# EAGLE design pico (EAGLE 6.4)
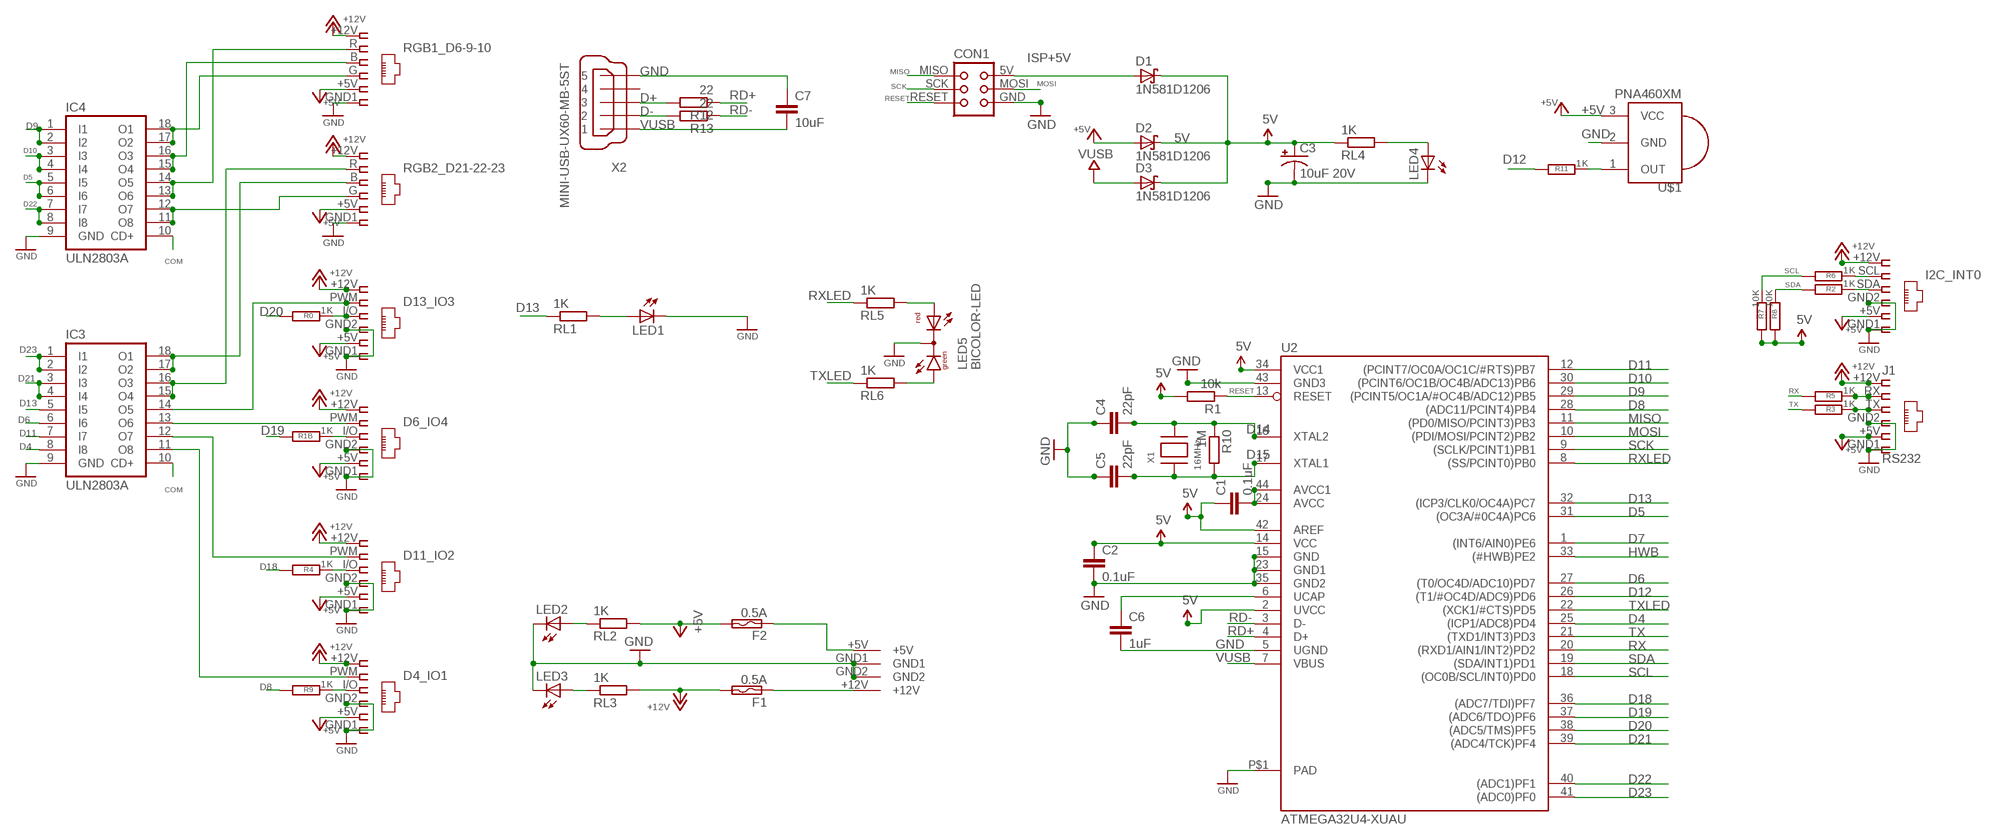
[diagram p0: schematic, sheet 1]

## Parts
C1  0.1uF  C-EUC1206  [C1206]
C2  0.1uF  C-EUC1206  [C1206]
C3  10uF 20V  CAP_POL1206-KIT  [EIA3216-KIT]
C4  22pF  C-EUC1206  [C1206]
C5  22pF  C-EUC1206  [C1206]
C6  1uF  C-EUC1206  [C1206]
C7  10uF  C-EUC1206  [C1206]
CON1  TINYISPT  [TC2030-MCP-NL]
D1  1N581D1206  [LED-1206]
D2  1N581D1206  [LED-1206]
D3  1N581D1206  [LED-1206]
D4_IO1  IO1  RJ12STRAIGHT  [RJ12-STRAIGHT]
D6_IO4  IO3  RJ12STRAIGHT  [RJ12-STRAIGHT]
D11_IO2  IO2  RJ12STRAIGHT  [RJ12-STRAIGHT]
D13_IO3  IO4  RJ12STRAIGHT  [RJ12-STRAIGHT]
F1  0.5A  POLYSWITCHSMD1812  [C1812]
F2  0.5A  POLYSWITCHSMD1812  [C1812]
I2C_INT0  I2C  RJ12STRAIGHT-I2C  [RJ12-STRAIGHT-I2C]
IC3  ULN2803A  [SO18W]
IC4  ULN2803A  [SO18W]
J1  RS232  RJ12STRAIGHT-RS232-SERVER  [RJ12-STRAIGHT-RS232]
LED1  LED3MM  [LED3MM]
LED2  5V  LED3MM  [LED3MM]
LED3  12V  LED3MM  [LED3MM]
LED4  5V uC  LED3MM  [LED3MM]
LED5  BICOLOR-LED  [BICOLOR-3MM]
R0  1K  R-EU_M1206  [M1206]
R1  10k  R-EU_M1206  [M1206]
R1B  1K  R-EU_M1206  [M1206]
R2  1K  R-EU_M1206  [M1206]
R3  1K  R-EU_M1206  [M1206]
R4  1K  R-EU_M1206  [M1206]
R5  1K  R-EU_M1206  [M1206]
R6  1K  R-EU_M1206  [M1206]
R7  10K  R-EU_M1206  [M1206]
R8  10K  R-EU_M1206  [M1206]
R9  1K  R-EU_M1206  [M1206]
R10  1M  R-EU_M1206  [M1206]
R11  1K  R-EU_M1206  [M1206]
R12  22  R-EU_M1206  [M1206]
R13  22  R-EU_M1206  [M1206]
RGB1_D6-9-10  RGB1  RJ12STRAIGHT-RGB  [RJ12-STRAIGHT-RGB]
RGB2_D21-22-23  RGB2  RJ12STRAIGHT-RGB  [RJ12-STRAIGHT-RGB]
RL1  1K  R-EU_M1206  [M1206]
RL2  1K  R-EU_M1206  [M1206]
RL3  1K  R-EU_M1206  [M1206]
RL4  1K  R-EU_M1206  [M1206]
RL5  1K  R-EU_M1206  [M1206]
RL6  1K  R-EU_M1206  [M1206]
U2  ATMEGA32U4-XUAU  [TQFP44-PAD]
U$1  PNA460XM  [PNA460XM]
U$2  KPJX-4S-S  [KPJX-4S-S]
X1  16MHz  XTALNX6035  [NX6035]
X2  MINI-USB-UX60-MB-5ST  [UX60-MB-5ST]

## Nets
5V: C1.1 C2.1 C3.A(+) D1.C D2.C D3.C R1.2 R7.2 R8.2 RL4.1 U2.2(UVCC) U2.14(VCC) U2.34(VCC1) U2.42(AREF)
+5V: D2.A D4_IO1.+5V D6_IO4.+5V D11_IO2.+5V D13_IO3.+5V F2.2 I2C_INT0.+5V J1.+5V RGB1_D6-9-10.+5V RGB2_D21-22-23.+5V RL2.2 U$1.3(VCC)
+12V: D4_IO1.+12V D6_IO4.+12V D11_IO2.+12V D13_IO3.+12V F1.2 I2C_INT0.+12V J1.+12V RGB1_D6-9-10.+12V RGB2_D21-22-23.+12V RL3.2
COM: IC3.10(CD+) IC4.10(CD+)
D2B: D11_IO2.I/O R4.1
D2B1: D4_IO1.I/O R9.1
D2B4: I2C_INT0.SDA R2.1
D2B5: J1.TX R3.1
D2B6: D13_IO3.I/O R0.1
D2B7: D6_IO4.I/O R1B.1
D4 [fine]: IC3.8(I8) U2.25((ICP1/ADC8)PD4)
D5 [fine]: IC4.5(I5) IC4.6(I6) U2.31((OC3A/#0C4A)PC6)
D6 [fine]: IC3.6(I6) U2.27((T0/OC4D/ADC10)PD7)
D7: U2.1((INT6/AIN0)PE6)
D8 [fine]: R9.2 U2.28((ADC11/PCINT4)PB4)
D9 [fine]: IC4.1(I1) IC4.2(I2) U2.29((PCINT5/OC1A/#OC4B/ADC12)PB5)
D10 [fine]: IC4.3(I3) IC4.4(I4) U2.30((PCINT6/OC1B/OC4B/ADC13)PB6)
D11 [fine]: IC3.7(I7) U2.12((PCINT7/OC0A/OC1C/#RTS)PB7)
D12: R11.2 U2.26((T1/#OC4D/ADC9)PD6)
D13 [fine]: IC3.5(I5) RL1.1 U2.32((ICP3/CLK0/OC4A)PC7)
D14 [fine]: C4.2 R10.1 U2.16(XTAL2) X1.P$2
D15 [fine]: C5.2 R10.2 U2.17(XTAL1) X1.P$1
D18 [fine]: R4.2 U2.36((ADC7/TDI)PF7)
D19 [fine]: R1B.2 U2.37((ADC6/TDO)PF6)
D20 [fine]: R0.2 U2.38((ADC5/TMS)PF5)
D21 [fine]: IC3.3(I3) IC3.4(I4) U2.39((ADC4/TCK)PF4)
D22 [fine]: IC4.7(I7) IC4.8(I8) U2.40((ADC1)PF1)
D23 [fine]: IC3.1(I1) IC3.2(I2) U2.41((ADC0)PF0)
D+: R12.2 X2.3
D-: R13.2 X2.2
GND: C2.2 C3.C(-) C4.1 C5.1 C6.2 C7.1 CON1.GND D4_IO1.GND1 D4_IO1.GND2 D6_IO4.GND1 D6_IO4.GND2 D11_IO2.GND1 D11_IO2.GND2 D13_IO3.GND1 D13_IO3.GND2 I2C_INT0.GND1 I2C_INT0.GND2 IC3.9(GND) IC4.9(GND) J1.GND1 J1.GND2 LED1.K(C) LED2.K(C) LED3.K(C) LED4.K(C) LED5.2(C) RGB1_D6-9-10.GND1 RGB2_D21-22-23.GND1 U2.5(UGND) U2.15(GND) U2.23(GND1) U2.35(GND2) U2.43(GND3) U2.P$1(PAD) U$1.2(GND) U$2.GND1 U$2.GND2 X2.5
HWB: U2.33((#HWB)PE2)
ISP+5V: CON1.5V(VCC) D1.A
MISO [fine]: CON1.MISO U2.11((PD0/MISO/PCINT3)PB3)
MOSI [fine]: CON1.MOSI U2.10((PDI/MOSI/PCINT2)PB2)
N$1 [PWM]: IC4.17(O2) IC4.18(O1) RGB1_D6-9-10.G
N$2 [PWM]: D6_IO4.PWM IC3.13(O6)
N$3: LED1.A RL1.2
N$4: C6.1 U2.6(UCAP)
N$6: F2.1 U$2.+5V
N$7: LED4.A RL4.2
N$8: F1.1 U$2.+12V
N$9: R11.1 U$1.1(OUT)
N$10: C1.2 U2.24(AVCC) U2.44(AVCC1)
N$11: LED5.3(AR) RL5.2
N$12: LED5.1(AG) RL6.2
N$13 [PWM]: IC3.15(O4) IC3.16(O3) RGB2_D21-22-23.R
N$22 [PWM]: D11_IO2.PWM IC3.12(O7)
N$48 [PWM]: IC3.17(O2) IC3.18(O1) RGB2_D21-22-23.B
N$50 [PWM]: IC4.15(O4) IC4.16(O3) RGB1_D6-9-10.B
N$51 [PWM]: D4_IO1.PWM IC3.11(O8)
N$57 [PWM]: IC4.11(O8) IC4.12(O7) RGB2_D21-22-23.G
N$60 [PWM]: D13_IO3.PWM IC3.14(O5)
N$68 [PWM]: IC4.13(O6) IC4.14(O5) RGB1_D6-9-10.R
N$70: J1.RX R5.1
N$71: I2C_INT0.SCL R6.1
N$75: LED3.A RL3.1
N$76: LED2.A RL2.1
RD+ [fine]: R12.1 U2.4(D+)
RD- [fine]: R13.1 U2.3(D-)
RESET [fine]: CON1.RESET R1.1 U2.13(RESET)
RX [fine]: R5.2 U2.20((RXD1/AIN1/INT2)PD2)
RXLED [fine]: RL5.1 U2.8((SS/PCINT0)PB0)
SCK [fine]: CON1.SCK U2.9((SCLK/PCINT1)PB1)
SCL [fine]: R6.2 R7.1 U2.18((OC0B/SCL/INT0)PD0)
SDA [fine]: R2.2 R8.1 U2.19((SDA/INT1)PD1)
TX [fine]: R3.2 U2.21((TXD1/INT3)PD3)
TXLED [fine]: RL6.1 U2.22((XCK1/#CTS)PD5)
VUSB: C7.2 D3.A U2.7(VBUS) X2.1
Unconnected: X2.4

## Library data of the parts
C1 C2 C4-C7 = resistor:C-EU: CAPACITOR, European symbol
C3 = SparkFun:CAP_POL: Capacitor Polarized These are standard SMD and PTH capacitors. Normally 10uF, 47uF, and 100uF in electrolytic and tantalum varieties. Always verify the external diameter of the through hole cap, it varies with capacity, voltage, and manufacturer. The EIA devices should be standard.
CON1 = lpatiny:TINYISP: CONNECTOR
D1-D3 = lpatiny:1N581*: 1.0A SCHOTTKY BARRIER RECTIFIER Source: http://www.diodes.com/datasheets/ds23001.pdf
D4_IO1 D6_IO4 D11_IO2 D13_IO3 I2C_INT0 J1 RGB1_D6-9-10 RGB2_D21-22-23 = lpatiny:RJ12: CORCOM Modular RJ Jacks No Shield Source: www.tycoelectronics.com .. ENG_DS_1654001_1099_RJ_L_0507.pdf
F1 F2 = lpatiny:POLYSWITCH: PolySwitch (TM) Resettable Device Source: Data sheet <http://www.farnell.com/datasheets/13482.pdf>
IC3 IC4 = lpatiny:ULN2803A: DRIVER ARRAY
LED1-LED4 = lpatiny:LED3MM
LED5 = lpatiny:BICOLOR-LED: T-1(3mm) BI-COLOR INDICATOR LAMP Source: Kingbright .. 2_colour_led_.pdf
R0 R1 R1B R2-R13 RL1-RL6 = resistor:R-EU_: RESISTOR, European symbol
U2 = SmartPrj:ATMEGA32U4-XU
U$1 = adafruit:PNA460XM: IR 38KHz receiver PNA4602 and related receivers http://www.ladyada.net/library/pcb/eaglelibrary.html
U$2 = lpatiny:KPJX-4S-S
X1 = lpatiny:XTAL: Low cost SMT crystals, no capacitors included http://www.ladyada.net/library/eagle
X2 = con-hirose:MINI-USB-: MINI USB Connector Source: http://www.hirose.co.jp/cataloge_hp/e24000019.pdf; OC_FARNELL: unknown; OC_NEWARK: unknown

## Net classes
0 default: width 0.457 mm
1 power: width 0.457 mm
2 highpower: width 0.914 mm
3 fine: width 0.457 mm
4 PWM: width 0.61 mm

## Board
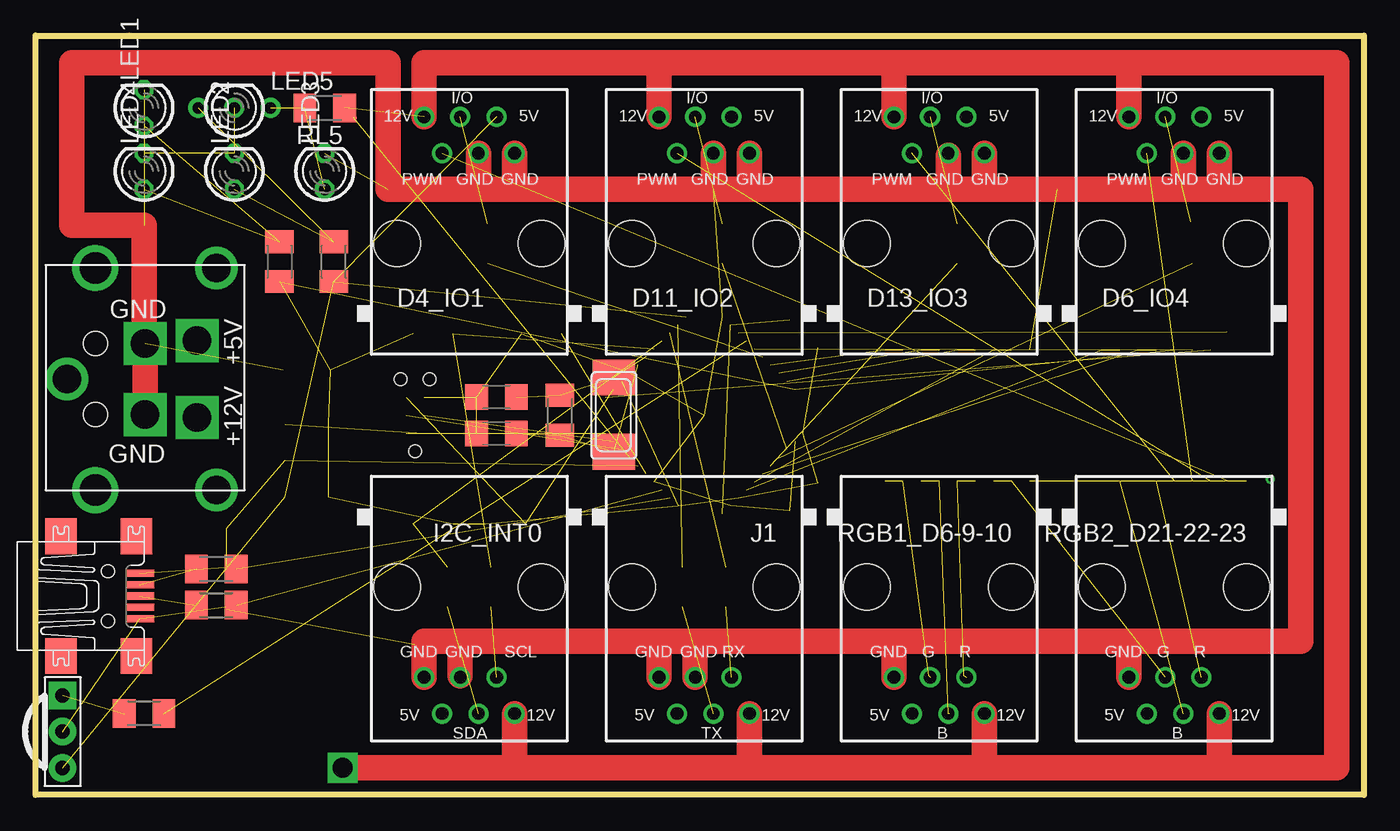
[diagram p1: board, top side]
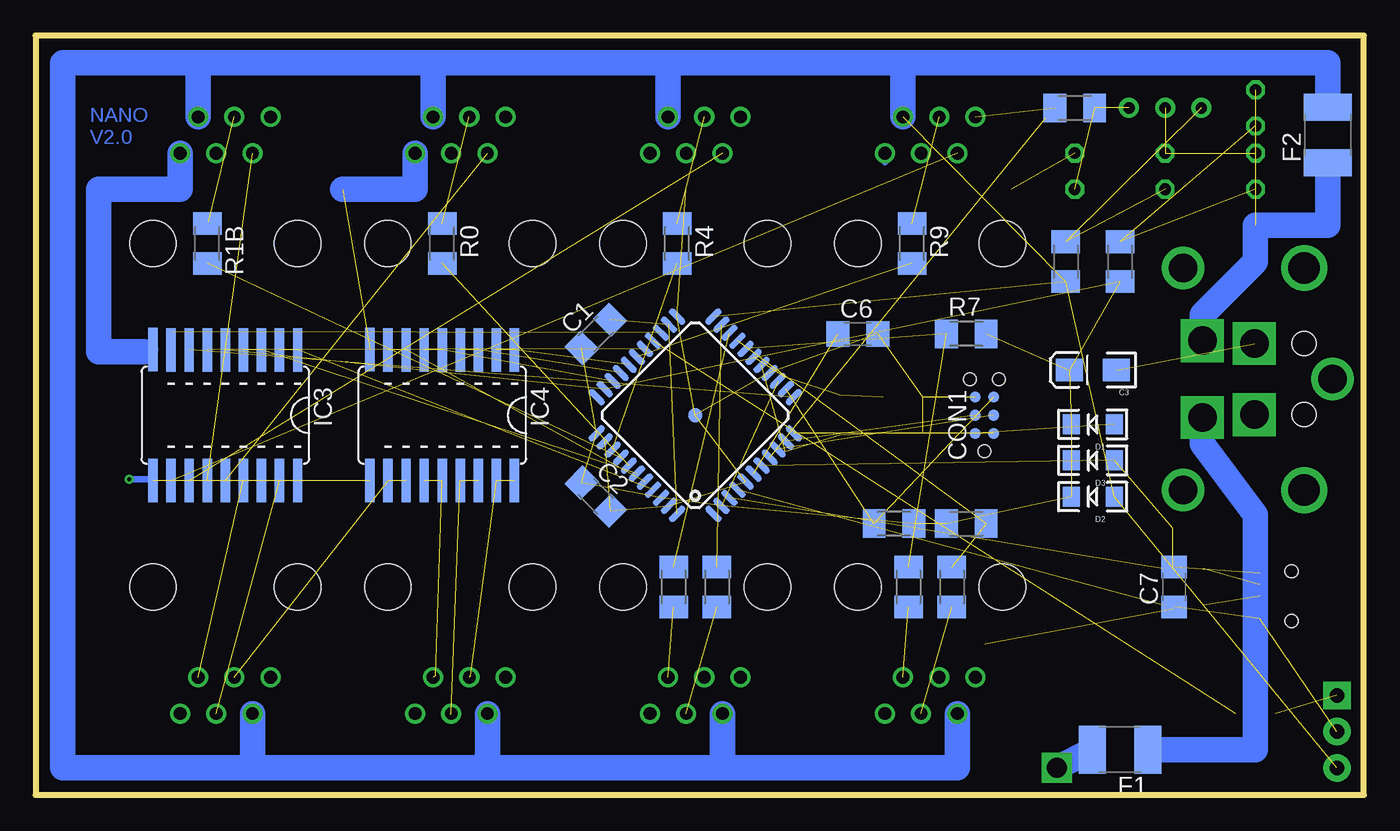
[diagram p2: board, bottom side, seen from below]

Size 93.34 x 53.34 mm. Coordinates in mm from the lower left corner, seen from the top.
Outline: 0,0 0,53.34 93.34,53.34 93.34,0 0,0
Copper layers (1*16): Top 0.035mm / dielectric 1.5mm / Bottom 0.035mm
Design rules "default": minimum track width 6mil, minimum drill 12mil, track to track 6mil, track to pad 6mil, pad to pad 6mil, via to via 6mil, smd to smd 0mil, copper to edge 10mil, drill to drill 10mil, minimum pad ring 10mil, minimum via ring 6mil, stop-mask expansion 2mil, vias tented up to drill 100mil, thermal gap 10mil
vRestrict: area 73.7,28.6 to 86.4,33.7; area 73.7,19.7 to 86.4,24.8; area 58.4,28.6 to 71.1,33.7; area 58.4,19.7 to 71.1,24.8; area 44.5,15.9 to 57.1,28.5; area 36.9,24.8 to 49.5,37.4; area 44.5,24.8 to 57.1,37.4; area 36.9,15.9 to 49.5,28.5; area 24.1,22.9 to 29.2,30.5

### Footprints (pad centres in the part's own frame; a part is rotated, then mirrored left to right if it is on the bottom)
C1206 = smd 1.6 x 1.8: 1 -1.4,0; 2 1.4,0
EIA3216-KIT = smd 1.9 x 1.6: A 1.65,0; C -1.65,0
TC2030-MCP-NL = smd 0.787 x 0.787: 5V 1.27,0.635; GND 3.81,0.635; MISO 1.27,-0.635; MOSI 2.54,0.635; RESET 3.81,-0.635; SCK 2.54,-0.635 | hole 0.889: 0,0; 5.08,-1.016; 5.08,1.016
LED-1206 = smd 1.2 x 1.4: A -1.5,0; C 1.5,0
RJ12-STRAIGHT = drill 0.9 pad 1.4: +5V 1.905,8.89; +12V -3.175,8.89; GND1 3.175,6.35; GND2 0.635,6.35; I/O -0.635,8.89; PWM -1.905,6.35 | hole 3.251: -5.08,0; 5.08,0
C1812 = smd 1.9 x 3.4: 1 -1.95,0; 2 1.95,0
RJ12-STRAIGHT-I2C = drill 0.9 pad 1.4: +5V 1.905,8.89; +12V -3.175,8.89; GND1 3.175,6.35; GND2 0.635,6.35; SCL -1.905,6.35; SDA -0.635,8.89 | hole 3.251: -5.08,0; 5.08,0
SO18W = smd 0.66 x 3.048: 1 -5.08,-4.585; 2 -3.81,-4.585; 3 -2.54,-4.585; 4 -1.27,-4.585; 5 0,-4.585; 6 1.27,-4.585; 7 2.54,-4.585; 8 3.81,-4.585; 9 5.08,-4.623; 10 5.08,4.585; 11 3.81,4.585; 12 2.54,4.585; 13 1.27,4.585; 14 0,4.585; 15 -1.27,4.585; 16 -2.54,4.585; 17 -3.81,4.585; 18 -5.08,4.585
RJ12-STRAIGHT-RS232 = drill 0.9 pad 1.4: +5V 1.905,8.89; +12V -3.175,8.89; GND1 3.175,6.35; GND2 0.635,6.35; RX -1.905,6.35; TX -0.635,8.89 | hole 3.251: -5.08,0; 5.08,0
LED3MM = drill 0.813 octagon: A -1.27,0; K 1.27,0
BICOLOR-3MM = drill 0.8 pad 1.4: 1 -2.54,0; 2 0,0; 3 2.54,0
M1206 = smd 1.6 x 2: 1 -1.4,0; 2 1.4,0
RJ12-STRAIGHT-RGB = drill 0.9 pad 1.4: +5V 1.905,8.89; +12V -3.175,8.89; B -0.635,8.89; G 0.635,6.35; GND1 3.175,6.35; R -1.905,6.35 | hole 3.251: -5.08,0; 5.08,0
TQFP44-PAD = smd 1.4 x 0.45: 1 -5.8,4; 2 -5.8,3.2; 3 -5.8,2.4; 4 -5.8,1.6; 5 -5.8,0.8; 6 -5.8,0; 7 -5.8,-0.8; 8 -5.8,-1.6; 9 -5.8,-2.4; 10 -5.8,-3.2; 11 -5.8,-4; 23 5.8,-4; 24 5.8,-3.2; 25 5.8,-2.4; 26 5.8,-1.6; 27 5.8,-0.8; 28 5.8,0; 29 5.8,0.8; 30 5.8,1.6; 31 5.8,2.4; 32 5.8,3.2; 33 5.8,4 | smd 0.45 x 1.4: 12 -4,-5.8; 13 -3.2,-5.8; 14 -2.4,-5.8; 15 -1.6,-5.8; 16 -0.8,-5.8; 17 0,-5.8; 18 0.8,-5.8; 19 1.6,-5.8; 20 2.4,-5.8; 21 3.2,-5.8; 22 4,-5.8; 34 4,5.8; 35 3.2,5.8; 36 2.4,5.8; 37 1.6,5.8; 38 0.8,5.8; 39 0,5.8; 40 -0.8,5.8; 41 -1.6,5.8; 42 -2.4,5.8; 43 -3.2,5.8; 44 -4,5.8 | smd 1 x 1: P$1 0,0
PNA460XM = drill 1.016 pad 1.93 square: 1 -2.54,0 | drill 1.016 pad 1.93: 2 0,0; 3 2.54,0
KPJX-4S-S = drill 2 square: +5V 2.7,1.35; +12V -2.7,1.35; GND1 -2.5,5; GND2 2.5,5 | drill 2: P$1 -7.8,0; P$2 7.8,0; P$11 0,10.5 | drill 2.2: P$3 -7.8,8.5; P$4 7.8,8.5 | hole 1.7: -2.5,8.5; 2.5,8.5
NX6035 = smd 2.5 x 3: P$1 2.665,0; P$2 -2.565,0
UX60-MB-5ST = smd 2 x 0.5: 1 2.25,1.6; 2 2.25,0.8; 3 2.25,0; 4 2.25,-0.8; 5 2.25,-1.6 | smd 2.2 x 2.5: M1 -3.3,-4.2; M2 -3.3,4.2; M3 2,4.2; M4 2,-4.2 | hole 0.9: 0,-1.75; 0,1.75

### Placement (x,y rotation side)
C1  53.98,32.38 45 bottom
C2  53.98,20.96 315 bottom
C3  19.05,29.85 180 bottom
C4  32.38,25.4 0 top
C5  32.38,27.94 0 top
C6  35.56,32.38 0 bottom
C7  13.34,14.61 90 bottom
CON1  26.67,24.13 90 bottom
D1  19.05,26.04 180 bottom
D2  19.05,20.96 180 bottom
D3  19.05,23.5 180 bottom
D4_IO1  30.48,38.73 0 top
D6_IO4  80.01,38.73 0 top
D11_IO2  46.99,38.73 0 top
D13_IO3  63.5,38.73 0 top
F1  17.14,3.17 180 bottom
F2  2.54,46.35 90 bottom
I2C_INT0  30.48,14.61 180 top
IC3  80.01,26.67 180 bottom
IC4  64.77,26.67 180 bottom
J1  46.99,14.61 180 top
LED1  7.62,48.26 90 top
LED2  13.97,43.81 90 top
LED3  20.32,43.81 90 top
LED4  7.62,43.81 90 top
LED5  13.97,48.26 0 top
R0  64.77,38.73 270 bottom
R1  33.02,19.05 0 bottom
R1B  81.28,38.73 270 bottom
R2  28.96,14.61 90 bottom
R3  45.47,14.61 90 bottom
R4  48.26,38.73 270 bottom
R5  48.51,14.61 90 bottom
R6  32,14.61 90 bottom
R7  27.94,32.38 0 bottom
R8  27.94,19.05 180 bottom
R9  31.75,38.73 270 bottom
R10  36.83,26.67 90 top
R11  7.62,5.71 0 top
R12  12.7,13.33 180 top
R13  12.7,15.88 180 top
RGB1_D6-9-10  63.5,14.61 180 top
RGB2_D21-22-23  80.01,14.61 180 top
RL1  17.14,37.46 90 bottom
RL2  20.95,37.46 270 top
RL3  20.32,48.26 180 bottom
RL4  17.14,37.46 90 top
RL5  20.32,48.26 180 top
RL6  20.95,37.46 90 bottom
U2  46.99,26.67 135 bottom
U$1  1.91,4.45 270 top
U$2  12.7,29.21 90 top
X1  40.64,26.67 90 top
X2  5.08,13.97 0 top

### Tracks (layer width: path | path; a pad name or v marks a point on that pad's centre or on a via)
5V  (13 unrouted)
+5V  (3 unrouted)
  Bottom 1.778: 32.38,51.43 2.54,51.43 F2.2 | 32.38,51.43 48.9,51.43 | 48.9,51.43 65.41,51.43 | 65.41,51.43 81.92,51.43 | 81.92,51.43 91.44,51.43 91.44,1.91 78.11,1.91 | 45.09,1.91 28.57,1.91 I2C_INT0.+5V | 45.09,1.91 61.59,1.91 | 78.11,1.91 61.59,1.91 | 61.59,1.91 RGB1_D6-9-10.+5V | RGB2_D21-22-23.+5V 78.11,1.91 | J1.+5V 45.09,1.91 | D6_IO4.+5V 81.92,51.43 | D13_IO3.+5V 65.41,51.43 | D11_IO2.+5V 48.9,51.43 | D4_IO1.+5V 32.38,51.43
+12V  (via drill 1.4)  (1 unrouted)
  Top 1.778: v21.59,1.91 33.66,1.91 | 66.67,1.91 83.19,1.91 | 66.67,1.91 50.16,1.91 | 50.16,1.91 33.66,1.91 | 83.19,1.91 91.44,1.91 91.44,51.43 76.83,51.43 | 76.83,51.43 60.33,51.43 | 60.33,51.43 43.81,51.43 | 43.81,51.43 27.3,51.43 D4_IO1.+12V | D11_IO2.+12V 43.81,51.43 | RGB1_D6-9-10.+12V 66.67,1.91 | RGB2_D21-22-23.+12V 83.19,1.91 | J1.+12V 50.16,1.91 | I2C_INT0.+12V 33.66,1.91 | D6_IO4.+12V 76.83,51.43 | D13_IO3.+12V 60.33,51.43
  Bottom 1.778: F1.2 v21.59,1.91
COM  (via drill 0.3)  (1 unrouted)
  Bottom 0.457: v86.77,22.17 85.14,22.17 IC3.10
D2B  (1 unrouted)
D2B1  (1 unrouted)
D2B4  (1 unrouted)
D2B5  (1 unrouted)
D2B6  (1 unrouted)
D2B7  (1 unrouted)
  Bottom 0.457: 81.18,40.26 R1B.1
D4  (1 unrouted)
  Bottom 0.457: 83.72,32.54 83.72,31.32 IC3.8
D5  (2 unrouted)
D6  (1 unrouted)
D8  (1 unrouted)
D9  (2 unrouted)
D10  (2 unrouted)
D11  (1 unrouted)
D12  (1 unrouted)
D13  (2 unrouted)
D14  (3 unrouted)
D15  (3 unrouted)
D18  (1 unrouted)
D19  (1 unrouted)
D20  (1 unrouted)
D21  (2 unrouted)
D22  (2 unrouted)
D23  (2 unrouted)
D+  (1 unrouted)
D-  (1 unrouted)
GND  (21 unrouted)
  Top 0.457: 29.82,8.36 I2C_INT0.GND2 | 59.54,10.39 60.33,10.79 | D13_IO3.GND2 64.21,45.14 64.14,44.93 | 26.62,10.59 27.3,10.59 | 8.13,26.04 U$2.GND1
  Top 1.27: U$2.GND2 7.62,31.71 | 29.82,8.36 29.84,8.36 | 64.11,44.93 64.14,44.93
  Top 1.778: U$2.GND1 U$2.GND2 | 7.62,31.71 7.62,40 2.54,40 2.54,51.43 24.77,51.43 24.77,42.54 31.11,42.54 | 31.11,42.54 33.66,42.54 | 33.66,42.54 47.62,42.54 | 47.62,42.54 50.16,42.54 | 50.16,42.54 64.14,42.54 | 64.14,42.54 66.67,42.54 | 66.67,42.54 80.64,42.54 | 80.64,42.54 83.19,42.54 | 83.19,42.54 88.9,42.54 88.9,10.79 76.83,10.79 | 29.84,10.79 27.3,10.79 27.3,10.59 I2C_INT0.GND1 | 29.84,10.79 43.81,10.79 | 46.35,10.79 43.81,10.79 | 46.35,10.79 60.33,10.79 | 76.83,10.79 60.33,10.79 | 60.33,10.79 RGB1_D6-9-10.GND1 | RGB2_D21-22-23.GND1 76.83,10.79 | J1.GND1 43.81,10.79 | J1.GND2 46.35,10.79 | D6_IO4.GND1 83.19,42.54 | D13_IO3.GND1 66.67,42.54 | D11_IO2.GND1 50.16,42.54 | D4_IO1.GND1 33.66,42.54 | 29.84,8.36 29.84,10.79 | D6_IO4.GND2 80.64,42.54 | 64.14,44.93 64.14,42.54 | D4_IO1.GND2 31.11,42.54 | D11_IO2.GND2 47.62,42.54
  Bottom 0.457: 33.66,44.45 33.83,44.93 D4_IO1.GND1 | 13.41,13.03 C7.1 | 27.23,8.36 I2C_INT0.GND1
  Bottom 0.762: IC3.9 85.72,31.29 85.72,31.12
  Bottom 1.778: 85.72,31.12 88.9,31.12 88.9,42.54 83.19,42.54 D6_IO4.GND1 | 71.75,42.54 66.67,42.54 D13_IO3.GND1
ISP+5V  (1 unrouted)
MISO  (1 unrouted)
MOSI  (1 unrouted)
N$1  (3 unrouted)
N$2  (1 unrouted)
N$3  (1 unrouted)
N$4  (1 unrouted)
N$6
  Bottom 0.457: 11.38,33.02 11.35,33.65 11.35,33.73
  Bottom 1.778: 11.35,33.73 7.62,37.46 7.62,40 2.54,40 F2.1 | U$2.+5V 11.35,33.65
N$7  (1 unrouted)
N$8
  Bottom 1.778: U$2.+12V 11.35,24.69 7.62,19.69 7.62,3.17 F1.1
N$9  (1 unrouted)
N$10  (2 unrouted)
N$11  (1 unrouted)
N$12  (1 unrouted)
N$13  (2 unrouted)
N$22  (1 unrouted)
N$48  (2 unrouted)
N$50  (3 unrouted)
N$51  (1 unrouted)
N$57  (2 unrouted)
N$60  (1 unrouted)
N$68  (3 unrouted)
N$70  (1 unrouted)
N$71  (1 unrouted)
N$75  (1 unrouted)
N$76  (1 unrouted)
RD+  (1 unrouted)
RD-  (1 unrouted)
RESET  (2 unrouted)
RX  (1 unrouted)
RXLED  (1 unrouted)
  Top 0.457: 22.35,47.57 21.74,48.18 RL5.1
SCK  (1 unrouted)
SCL  (2 unrouted)
SDA  (2 unrouted)
TX  (1 unrouted)
TXLED  (1 unrouted)
VUSB  (4 unrouted)
  Bottom 0.457: 13.41,16.08 C7.2

### Text on the board
Bottom: NANO / V2.0